# Altium schematic sheet 5V LDO.SchDoc
size A; SheetNumber: 7; SheetTotal: 19
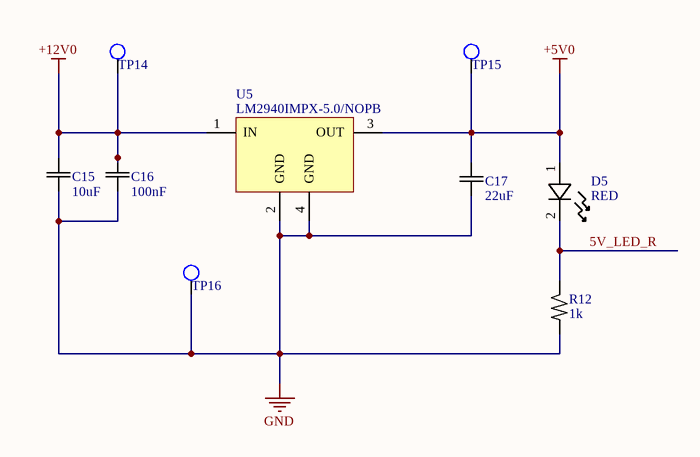
[diagram p0: 5V LDO.SchDoc]

## Parts
C15  10uF  [C1206]
C16  100nF  [C0603]
C17  22uF  [C1206]
D5  RED  [LED0805 RED]
R12  1k  [R0603]
TP14  TestPoint  [TESTPOINT_SMD_1.27MM]  (value not drawn)  (no BOM)
TP15  TestPoint  [TESTPOINT_SMD_1.27MM]  (value not drawn)  (no BOM)
TP16  TestPoint  [TESTPOINT_SMD_1.27MM]  (value not drawn)  (no BOM)
U5  LM2940IMPX-5.0/NOPB  [SOT-223]

## Nets
+5V0: C17.1 D5.1 TP15.1 U5.3(OUT)
+12V0: C15.2 C16.2 TP14.1 U5.1(IN)
GND: C15.1 C16.1 C17.2 R12.1 TP16.1 U5.2(GND) U5.4(GND)
5V_LED_R: D5.2 R12.2

## Notes on the sheet
- Project:
- Sheet Title:
- Size
- Date:
- A
- Sheet Number:
- Sheet Total:
- Revision:
- Time:
- Author:

## Library data of the parts
C15 = Cap_cer: CAP CER 10uF 25V X7R 1206; MF: SAMWHA; MP: CS3216X7R106K250NRI; ComponentLink1Description: Datasheet; ComponentLink1URL: https://www.lcsc.com/datasheet/C513767.pdf; ComponentLink2Description: Supplier1; ComponentLink2URL: https://www.lcsc.com/product-detail/C513767.html
C16 = Cap_cer: CAP CER 100nF 50V X7R 0603; MF: HRE; MP: CGA0603X7R104K500JT; ComponentLink1Description: Datasheet; ComponentLink1URL: https://www.lcsc.com/datasheet/C6119867.pdf; ComponentLink2Description: Supplier1; ComponentLink2URL: https://www.lcsc.com/product-detail/C6119867.html
C17 = Cap_cer: CAP CER 22uF 10V X7R 1206; MF: CCTC; MP: TCC1206X7R226K100HT; ComponentLink1Description: Datasheet; ComponentLink1URL: https://www.lcsc.com/datasheet/C20416445.pdf; ComponentLink2Description: Supplier1; ComponentLink2URL: https://www.lcsc.com/product-detail/C20416445.html
D5 = LED: LED RED WATER CLEAR 0805 SMD; MF: XINGLIGHT; MP: XL-TD2012SURC; ComponentLink1Description: Datasheet; ComponentLink1URL: https://www.lcsc.com/datasheet/C5349939.pdf; ComponentLink2Description: Supplier1; ComponentLink2URL: https://www.lcsc.com/product-detail/C5349939.html
R12 = Res: RES 1kΩ ±5% 100mW 0603; MF: VO; MP: SCR0603J1K; ComponentLink1Description: Datasheet; ComponentLink1URL: https://www.lcsc.com/datasheet/C3017736.pdf; ComponentLink2Description: Supplier1; ComponentLink2URL: https://www.lcsc.com/product-detail/C3017736.html
U5 = LM2940IMPX-5.0/NOPB: 72dB@(120Hz) Positive Fixed 5V SOT-223-4 Voltage Regulators - Linear, Low Drop Out (LDO) Regulators ROHS; MF: Texas Instruments; MP: LM2940IMPX-5.0/NOPB; ComponentLink1Description: Datasheet; ComponentLink1URL: https://www.lcsc.com/datasheet/C2859859.pdf; ComponentLink2Description: Supplier1; ComponentLink2URL: https://www.lcsc.com/product-detail/C2859859.html